# Altium schematic sheet ip_phone_a_sdram.SchDoc: SDRAM
size A3; SheetNumber: 1; SheetTotal: 6
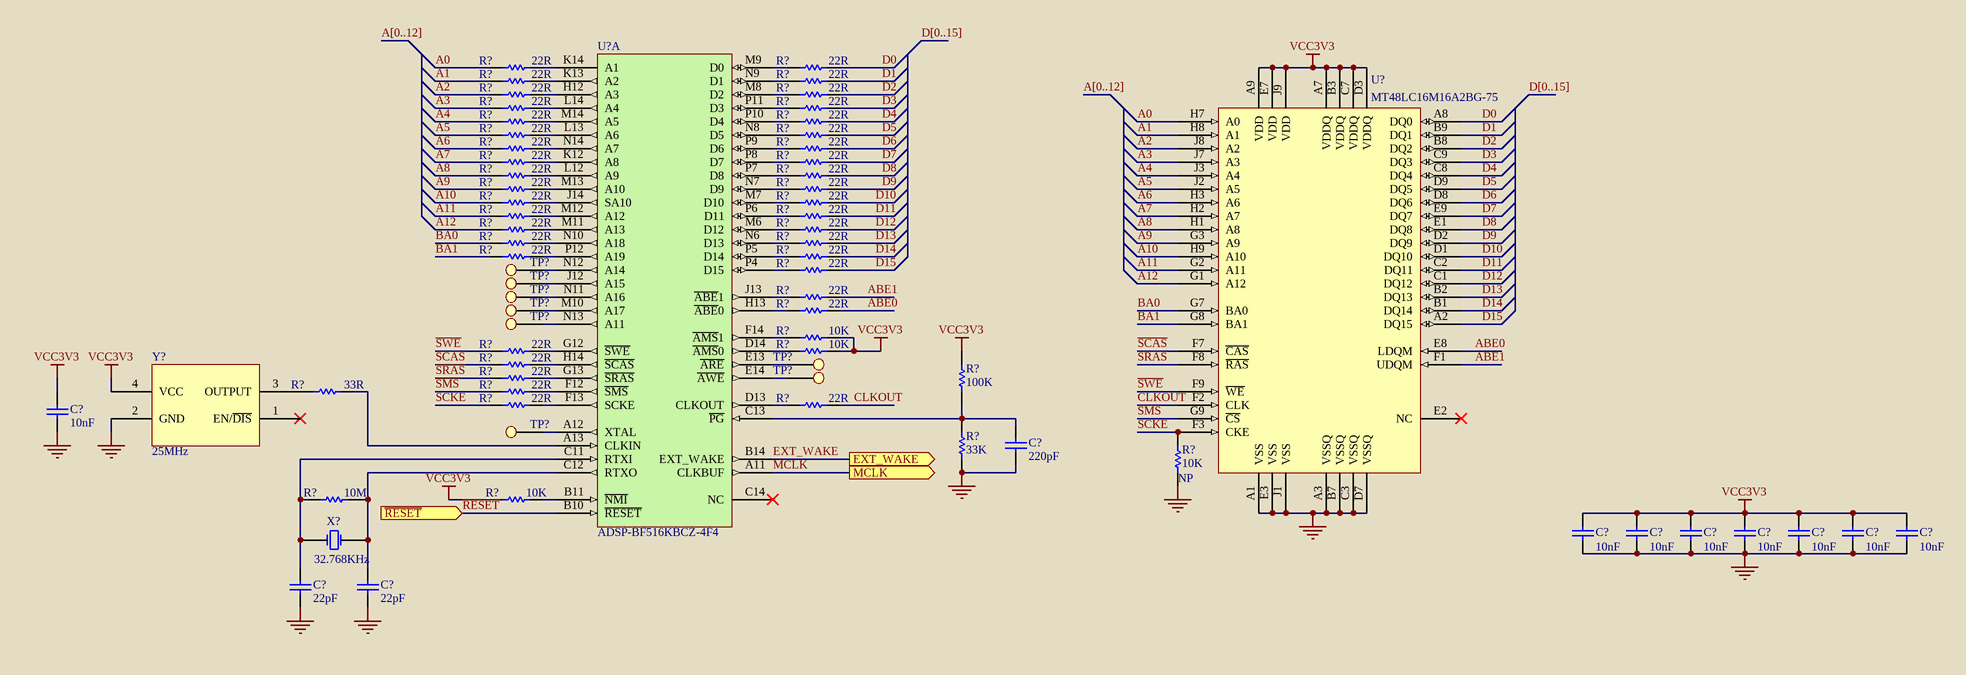
[diagram p0: ip_phone_a_sdram.SchDoc]

## Parts
(Parts that share a designator on the sheet are numbered #1, #2 ... from top to bottom, then left to right.)
C?#1  10nF  [CC1005-0402]
C?#2  220pF  [CC1005-0402]
C?#3  10nF  [CC1005-0402]
C?#4  10nF  [CC1005-0402]
C?#5  10nF  [CC1005-0402]
C?#6  10nF  [CC1005-0402]
C?#7  10nF  [CC1005-0402]
C?#8  10nF  [CC1005-0402]
C?#9  10nF  [CC1005-0402]
C?#10  22pF  [CC1005-0402]
C?#11  22pF  [CC1005-0402]
R?#1  22R  [CR1005-0402]
R?#2  22R  [CR1005-0402]
R?#3  22R  [CR1005-0402]
R?#4  22R  [CR1005-0402]
R?#5  22R  [CR1005-0402]
R?#6  22R  [CR1005-0402]
R?#7  22R  [CR1005-0402]
R?#8  22R  [CR1005-0402]
R?#9  22R  [CR1005-0402]
R?#10  22R  [CR1005-0402]
R?#11  22R  [CR1005-0402]
R?#12  22R  [CR1005-0402]
R?#13  22R  [CR1005-0402]
R?#14  22R  [CR1005-0402]
R?#15  22R  [CR1005-0402]
R?#16  22R  [CR1005-0402]
R?#17  22R  [CR1005-0402]
R?#18  22R  [CR1005-0402]
R?#19  22R  [CR1005-0402]
R?#20  22R  [CR1005-0402]
R?#21  22R  [CR1005-0402]
R?#22  22R  [CR1005-0402]
R?#23  22R  [CR1005-0402]
R?#24  22R  [CR1005-0402]
R?#25  22R  [CR1005-0402]
R?#26  22R  [CR1005-0402]
R?#27  22R  [CR1005-0402]
R?#28  22R  [CR1005-0402]
R?#29  22R  [CR1005-0402]
R?#30  22R  [CR1005-0402]
R?#31  22R  [CR1005-0402]
R?#32  22R  [CR1005-0402]
R?#33  22R  [CR1005-0402]
R?#34  10K  [CR1005-0402]
R?#35  22R  [CR1005-0402]
R?#36  10K  [CR1005-0402]
R?#37  22R  [CR1005-0402]
R?#38  22R  [CR1005-0402]
R?#39  33R  [CR1005-0402]
R?#40  22R  [CR1005-0402]
R?#41  22R  [CR1005-0402]
R?#42  22R  [CR1005-0402]
R?#43  100K  [CR1005-0402]
R?#44  33K  [CR1005-0402]
R?#45  10K  [CR1005-0402_NP]
R?#46  10M  [CR1005-0402]
R?#47  10K  [CR1005-0402]
TP?#1  Test Point  [Test Point]  (value not drawn)
TP?#2  Test Point  [Test Point]  (value not drawn)
TP?#3  Test Point  [Test Point]  (value not drawn)
TP?#4  Test Point  [Test Point]  (value not drawn)
TP?#5  Test Point  [Test Point]  (value not drawn)
TP?#6  Test Point  [Test Point]  (value not drawn)
TP?#7  Test Point  [Test Point]  (value not drawn)
TP?#8  Test Point  [Test Point]  (value not drawn)
U?#1  ADSP-BF516KBCZ-4F4  [BGA168]  (part A of 3)
U?#2  MT48LC16M16A2BG-75  [VFBGA54]
X?  32.768KHz  [XTAL_32.768kHz]
Y?  25MHz  [OSC_25MHz]

## Ports
EXT_WAKE (out), MCLK (out), ~{RESET} (in)

## Nets
GND: C?#1.1 C?#2.1 C?#3.1 C?#4.1 C?#5.1 C?#6.1 C?#7.1 C?#8.1 C?#9.1 C?#10.1 C?#11.1 R?#44.1 R?#45.1 U?#2.A1(VSS) U?#2.A3(VSSQ) U?#2.B7(VSSQ) U?#2.C3(VSSQ) U?#2.D7(VSSQ) U?#2.E3(VSS) U?#2.J1(VSS) Y?.2(GND)
VCC3V3: C?#1.2 C?#3.2 C?#4.2 C?#5.2 C?#6.2 C?#7.2 C?#8.2 C?#9.2 R?#34.2 R?#36.2 R?#43.2 R?#47.1 U?#2.A7(VDDQ) U?#2.A9(VDD) U?#2.B3(VDDQ) U?#2.C7(VDDQ) U?#2.D3(VDDQ) U?#2.E7(VDD) U?#2.J9(VDD) Y?.4(VCC)
~{RESET}: U?#1.B10(~{RESET}) ; port ~{RESET}
A0: R?#1.1 U?#2.H7(A0)
A1: R?#3.1 U?#2.H8(A1)
A2: R?#5.1 U?#2.J8(A2)
A3: R?#7.1 U?#2.J7(A3)
A4: R?#9.1 U?#2.J3(A4)
A5: R?#11.1 U?#2.J2(A5)
A6: R?#13.1 U?#2.H3(A6)
A7: R?#15.1 U?#2.H2(A7)
A8: R?#17.1 U?#2.H1(A8)
A9: R?#19.1 U?#2.G3(A9)
A10: R?#21.1 U?#2.H9(A10)
A11: R?#23.1 U?#2.G2(A11)
A12: R?#25.1 U?#2.G1(A12)
ABE0: R?#33.2 U?#2.E8(LDQM)
ABE1: R?#32.2 U?#2.F1(UDQM)
BA0: R?#27.1 U?#2.G7(BA0)
BA1: R?#29.1 U?#2.G8(BA1)
CLKOUT: R?#42.2 U?#2.F2(CLK)
D0: R?#2.2 U?#2.A8(DQ0)
D1: R?#4.2 U?#2.B9(DQ1)
D2: R?#6.2 U?#2.B8(DQ2)
D3: R?#8.2 U?#2.C9(DQ3)
D4: R?#10.2 U?#2.C8(DQ4)
D5: R?#12.2 U?#2.D9(DQ5)
D6: R?#14.2 U?#2.D8(DQ6)
D7: R?#16.2 U?#2.E9(DQ7)
D8: R?#18.2 U?#2.E1(DQ8)
D9: R?#20.2 U?#2.D2(DQ9)
D10: R?#22.2 U?#2.D1(DQ10)
D11: R?#24.2 U?#2.C2(DQ11)
D12: R?#26.2 U?#2.C1(DQ12)
D13: R?#28.2 U?#2.B2(DQ13)
D14: R?#30.2 U?#2.B1(DQ14)
D15: R?#31.2 U?#2.A2(DQ15)
EXT_WAKE: U?#1.B14(EXT_WAKE) ; port EXT_WAKE
MCLK: U?#1.A11(CLKBUF) ; port MCLK
~{SCAS}: R?#37.1 U?#2.F7(~{CAS})
~{SMS}: R?#40.1 U?#2.G9(~{CS})
~{SRAS}: R?#38.1 U?#2.F8(~{RAS})
~{SWE}: R?#35.1 U?#2.F9(~{WE})
SCKE: R?#41.1 R?#45.2 U?#2.F3(CKE)
NetC?#2_2: C?#2.2 R?#43.1 R?#44.2 U?#1.C13(~{PG})
NetC?#10_2: C?#10.2 R?#46.1 U?#1.C11(RTXI) X?.1(OSC1)
NetC?#11_2: C?#11.2 R?#46.2 U?#1.C12(RTXO) X?.4(OSC2)
NetR?#1_2: R?#1.2 U?#1.K14(A1)
NetR?#2_1: R?#2.1 U?#1.M9(D0)
NetR?#3_2: R?#3.2 U?#1.K13(A2)
NetR?#4_1: R?#4.1 U?#1.N9(D1)
NetR?#5_2: R?#5.2 U?#1.H12(A3)
NetR?#6_1: R?#6.1 U?#1.M8(D2)
NetR?#7_2: R?#7.2 U?#1.L14(A4)
NetR?#8_1: R?#8.1 U?#1.P11(D3)
NetR?#9_2: R?#9.2 U?#1.M14(A5)
NetR?#10_1: R?#10.1 U?#1.P10(D4)
NetR?#11_2: R?#11.2 U?#1.L13(A6)
NetR?#12_1: R?#12.1 U?#1.N8(D5)
NetR?#13_2: R?#13.2 U?#1.N14(A7)
NetR?#14_1: R?#14.1 U?#1.P9(D6)
NetR?#15_2: R?#15.2 U?#1.K12(A8)
NetR?#16_1: R?#16.1 U?#1.P8(D7)
NetR?#17_2: R?#17.2 U?#1.L12(A9)
NetR?#18_1: R?#18.1 U?#1.P7(D8)
NetR?#19_2: R?#19.2 U?#1.M13(A10)
NetR?#20_1: R?#20.1 U?#1.N7(D9)
NetR?#21_2: R?#21.2 U?#1.J14(SA10)
NetR?#22_1: R?#22.1 U?#1.M7(D10)
NetR?#23_2: R?#23.2 U?#1.M12(A12)
NetR?#24_1: R?#24.1 U?#1.P6(D11)
NetR?#25_2: R?#25.2 U?#1.M11(A13)
NetR?#26_1: R?#26.1 U?#1.M6(D12)
NetR?#27_2: R?#27.2 U?#1.N10(A18)
NetR?#28_1: R?#28.1 U?#1.N6(D13)
NetR?#29_2: R?#29.2 U?#1.P12(A19)
NetR?#30_1: R?#30.1 U?#1.P5(D14)
NetR?#31_1: R?#31.1 U?#1.P4(D15)
NetR?#32_1: R?#32.1 U?#1.J13(~{ABE}1)
NetR?#33_1: R?#33.1 U?#1.H13(~{ABE}0)
NetR?#34_1: R?#34.1 U?#1.F14(~{AMS}1)
NetR?#35_2: R?#35.2 U?#1.G12(~{SWE})
NetR?#36_1: R?#36.1 U?#1.D14(~{AMS}0)
NetR?#37_2: R?#37.2 U?#1.H14(~{SCAS})
NetR?#38_2: R?#38.2 U?#1.G13(~{SRAS})
NetR?#39_1: R?#39.1 Y?.3(OUTPUT)
NetR?#39_2: R?#39.2 U?#1.A13(CLKIN)
NetR?#40_2: R?#40.2 U?#1.F12(~{SMS})
NetR?#41_2: R?#41.2 U?#1.F13(SCKE)
NetR?#42_1: R?#42.1 U?#1.D13(CLKOUT)
NetR?#47_2: R?#47.2 U?#1.B11(~{NMI})
NetTP?#1_1: TP?#1.1 U?#1.N12(A14)
NetTP?#2_1: TP?#2.1 U?#1.J12(A15)
NetTP?#3_1: TP?#3.1 U?#1.N11(A16)
NetTP?#4_1: TP?#4.1 U?#1.M10(A17)
NetTP?#5_1: TP?#5.1 U?#1.N13(A11)
NetTP?#6_1: TP?#6.1 U?#1.E13(~{ARE})
NetTP?#7_1: TP?#7.1 U?#1.E14(~{AWE})
NetTP?#8_1: TP?#8.1 U?#1.A12(XTAL)

Not connected (* = marked no-connect by the designer): U?#1 C14(NC)*; U?#2 E2(NC)*; Y? 1(EN/~{DIS})*

## Buses and harness runs
bus A[0..12]
bus D[0..15]

## Notes on the sheet
- Título:
- Universidade Federal do Ceará
- Padrão:
- Projeto:
- A3
- Blackfin IP Phone
- Data:
- Versão:
- Folha:
- V1
- de
- Centro de Tecnologia
- Dep. de Eng. de Teleinformática
- Fortaleza - Ceará - Brasil
- Arquivo:

## Library data of the parts
C?#1 = Capacitor: Ceramic Capacitor 10nF 50V X7R 0402; eVendorPart#: 311-1349-1-ND; Manufacturer: Yageo; Part#: CC0402KRX7R9BB103; eVendor: Digikey; eVendorPrice: 0,015; MSRP: 0,00335; MOQ: 1000
C?#2 = Capacitor: eVendorPart#: 311-1035-1-ND; Manufacturer: Yageo; Part#: CC0402KRX7R9BB221; eVendor: Digikey; eVendorPrice: 0,015; MSRP: 0,00335; MOQ: 1000
C?#3-C?#9 = Capacitor: Ceramic Capacitor 0.01uF 50V X7R 0402; eVendorPart#: 311-1349-1-ND; Manufacturer: Yageo; Part#: CC0402KRX7R9BB103; eVendor: Digikey; eVendorPrice: 0,015; MSRP: 0,00335; MOQ: 1000
C?#10 C?#11 = Capacitor: Ceramic Capacitor 22pF 50V 5% C0G 0402; eVendorPart#: 490-1283-1-ND; Manufacturer: Murata Electronics North America; Part#: GRM1555C1H220JZ01D; eVendor: Digikey; eVendorPrice: 0,028; MSRP: 0,00614; MOQ: 1000
R?#1-R?#33 R?#35 R?#37 R?#38 R?#40-R?#42 = Resistor: Thick Film Resistors SMD 0402 22R 5%  1/16 W; eVendorPart#: 71-CRCW0402J-22-E3; Manufacturer: Vishay/Dale; Part#: CRCW040222R0JNED; eVendor: Mouser; eVendorPrice: 0,08; MSRP: 0,015; MOQ: 1000
R?#34 = Resistor: Thick Film Resistors SMD 0402 10k 5%  1/16 W; eVendorPart#: 311-10KJRCT-ND; Manufacturer: Yageo; Part#: RC0402JR-0710KL; eVendor: Digikey; eVendorPrice: 0,012; MSRP: 0,00253; MOQ: 1000
R?#36 = Resistor: Thick Film Resistors SMD 0402 10k 5%  1/16 W; eVendorPart#: 311-10KJRCT-ND; Manufacturer: Yageo; Part#: RC0402JR-0710KL; eVendor: Digikey; eVendorPrice: 0,0012; MSRP: 0,00253; MOQ: 1000
R?#39 = Resistor: Thick Film Resistors SMD 0402 33R 5%  1/16 W; eVendorPart#: 311-33JRCT-ND; Manufacturer: Yageo; Part#: RC0402JR-0733RL; eVendor: Digikey; eVendorPrice: 0,012; MSRP: 0,00253; MOQ: 1000
R?#43 = Resistor: Thick Film Resistors SMD 0402 100K 5%  1/16 W; eVendorPart#: 311-100KJRCT-ND; Manufacturer: Yageo; Part#: RC0402JR-07100KL; eVendor: Digikey; eVendorPrice: 0,012; MSRP: 0,00253; MOQ: 1000
R?#44 = Resistor: Thick Film Resistors SMD 0402 33K 5%  1/16 W; eVendorPart#: 311-33KJRCT-ND; Manufacturer: Yageo; Part#: RC0402JR-0733KL; eVendor: Digikey; eVendorPrice: 0,012; MSRP: 0,00253; MOQ: 1000
R?#45 R?#47 = Resistor: Thick Film Resistors SMD 0402 10K 5%  1/16 W; eVendorPart#: 311-10KJRCT-ND; Manufacturer: Yageo; Part#: RC0402JR-0710KL; eVendor: Digikey; eVendorPrice: 0,012; MSRP: 0,00253; MOQ: 1000
  R?#45: NP: NP
R?#46 = Resistor: Thick Film Resistors SMD 0402 10M 5%  1/16 W; eVendorPart#: RMCF0402JT10M0CT-ND; Manufacturer: Stackpole Electronics Inc; Part#: RMCF0402JT10M0; eVendor: Digikey; eVendorPrice: 0,02; MSRP: 0,00256; MOQ: 1000
TP?#1-TP?#8 = Test Point: eVendor: NÃO SE APLICA; eVendorPrice: 0,00; eVendorPart#: NÃO SE APLICA; Part#: NÃO SE APLICA; Manufacturer: NÃO SE APLICA; MOQ: 1000; MSRP: 0,00
U?#1 = ADSP-BF516KBCZ-4F4: Low Power Blackfin with Advanced Embedded Connectivity; Manufacturer: Analog Device; eVendor: Avnet; eVendorPrice: 19,42; MSRP: 14,15; eVendorPart#: ADSP-BF516KBCZ-4F4; MOQ: 500; Part#: ADSP-BF516KBCZ-4F4
U?#2 = MT48LC16M16A2BG-75: SDRAM 256M-Bit 16Mx16 3.3V 54-Pin VFBGA Tray; eVendorPart#: MT48LC16M16A2BG-75 IT:D; Manufacturer: Micron; eVendor: Avnet; eVendorPrice: 9,23; MSRP: 8,33; MOQ: 100; Part#: MT48LC16M16A2BG-75 IT:D
X? = XTAL_32.768KHz: Crystal 32.768KHz; eVendorPart#: 732-MC30632.7680KA0R; Part#: MC-306 32.7680K-A0:ROHS; Manufacturer: Epson; eVendor: Mouser; eVendorPrice: 0,95; MSRP: 0,378; MOQ: 1000
Y? = Oscillator_25MHz: Crystal Clock Oscillator 25MHz  50ppm 3.3V; eVendorPart#: 300-8254-1-ND; Part#: ASFL1-25.000MHZ-EC-T; Manufacturer: ABRACON; eVendor: Digikey; eVendorPrice: 2,55; MSRP: 1,292; MOQ: 1000